# EAGLE design ioboard (EAGLE 9.6.2)
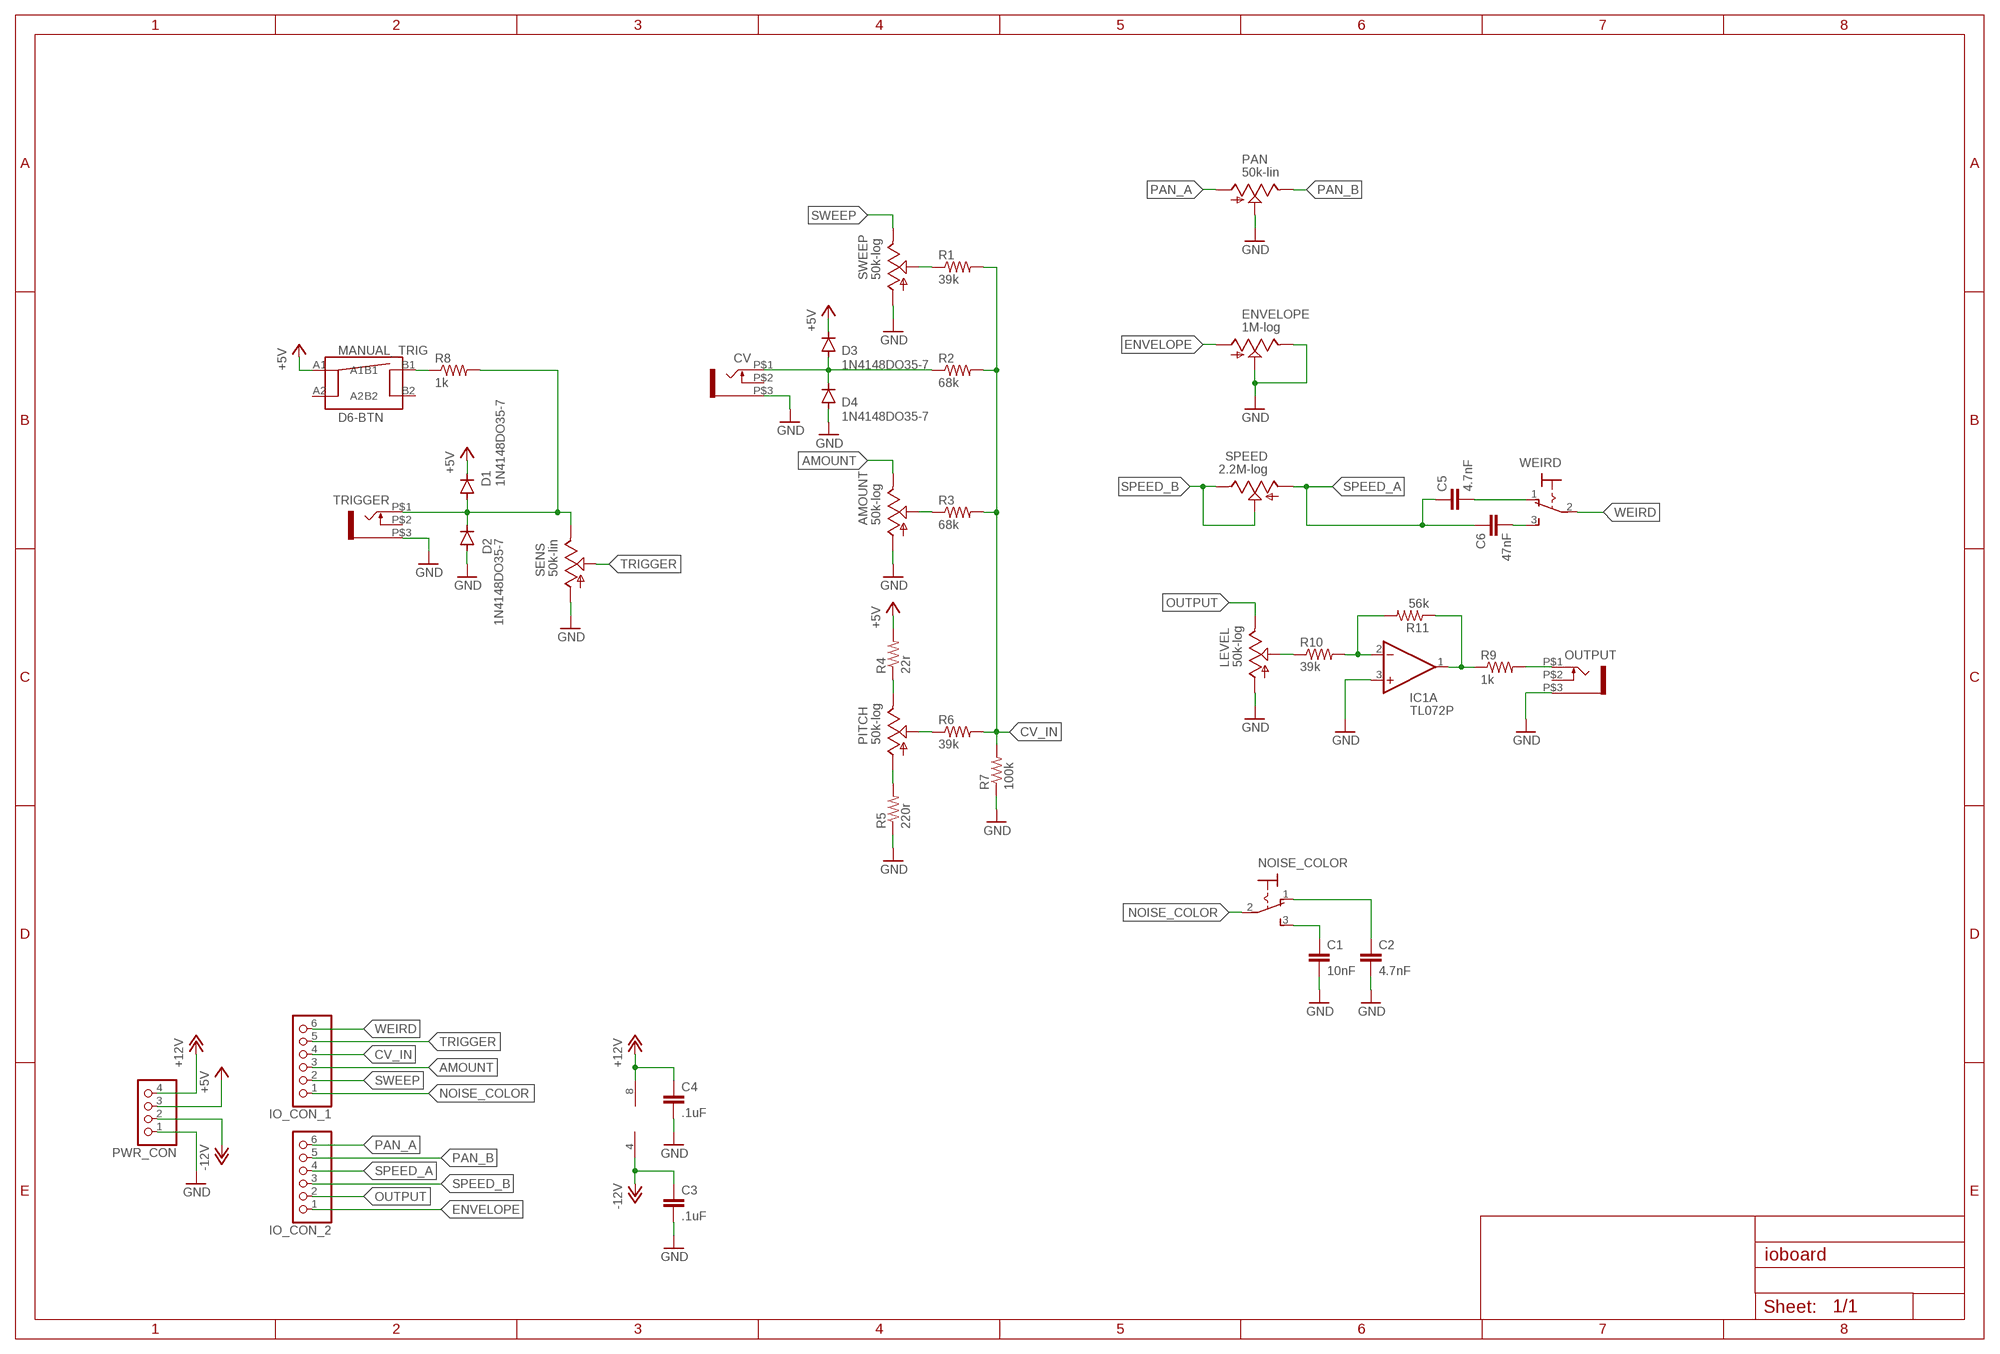
[diagram p0: schematic, sheet 1]

## Parts
AMOUNT  50k-log  ALPHA-9MMA  [EVUF]
C1  10nF  C-EU050-024X044  [C050-024X044]
C2  4.7nF  C-EU050-024X044  [C050-024X044]
C3  .1uF  C-EU050-024X044  [C050-024X044]
C4  .1uF  C-EU050-024X044  [C050-024X044]
C5  4.7nF  C-EU050-024X044  [C050-024X044]
C6  47nF  C-EU050-024X044  [C050-024X044]
CV  WQP-PJ301M-12_JACK  [WQP-PJ301M-12_JACK]
D1  1N4148DO35-7  [DO35-7]
D2  1N4148DO35-7  [DO35-7]
D3  1N4148DO35-7  [DO35-7]
D4  1N4148DO35-7  [DO35-7]
ENVELOPE  1M-log  ALPHA-9MMA  [EVUF]
IC1  TL072P  [DIL08]
IO_CON_1  PINHD-1X6  [1X06]
IO_CON_2  PINHD-1X6  [1X06]
LEVEL  50k-log  ALPHA-9MMA  [EVUF]
MANUAL_TRIG  D6-BTN  [D6-BTN]
NOISE_COLOR  M9040P  [M9040P]
OUTPUT  WQP-PJ301M-12_JACK  [WQP-PJ301M-12_JACK]
PAN  50k-lin  ALPHA-9MMA  [EVUF]
PITCH  50k-log  ALPHA-9MMA  [EVUF]
PWR_CON  PINHD-1X4  [1X04]
R1  39k  R-US_0207/7  [0207/7]
R2  68k  R-US_0207/7  [0207/7]
R3  68k  R-US_0207/7  [0207/7]
R4  22r  R-US_0207/7  [0207/7]
R5  220r  R-US_0207/7  [0207/7]
R6  39k  R-US_0207/7  [0207/7]
R7  100k  R-US_0207/7  [0207/7]
R8  1k  R-US_0207/7  [0207/7]
R9  1k  R-US_0207/7  [0207/7]
R10  39k  R-US_0207/7  [0207/7]
R11  56k  R-US_0207/7  [0207/7]
SENS  50k-lin  ALPHA-9MMA  [EVUF]
SPEED  2.2M-log  ALPHA-9MMA  [EVUF]
SWEEP  50k-log  ALPHA-9MMA  [EVUF]
TRIGGER  WQP-PJ301M-12_JACK  [WQP-PJ301M-12_JACK]
WEIRD  M9040P  [M9040P]

## Nets
+5V: D1.C D3.C MANUAL_TRIG.A1 PWR_CON.3 R4.2
+12V: C4.1 IC1.8(P:V+) PWR_CON.4
-12V: C3.1 IC1.4(P:V-) PWR_CON.2
AMOUNT: AMOUNT.3(E) IO_CON_1.3
CV_IN: IO_CON_1.4 R1.2 R2.2 R3.2 R6.2 R7.2
ENVELOPE: ENVELOPE.1(A) IO_CON_2.1
GND: AMOUNT.1(A) C1.2 C2.2 C3.2 C4.2 CV.P$3 D2.A D4.A ENVELOPE.2(S) ENVELOPE.3(E) IC1.3(A:+IN) LEVEL.1(A) OUTPUT.P$3 PAN.2(S) PWR_CON.1 R5.1 R7.1 SENS.1(A) SWEEP.1(A) TRIGGER.P$3
N$1: PITCH.1(A) R5.2
N$2: PITCH.2(S) R6.1
N$3: PITCH.3(E) R4.1
N$4: AMOUNT.2(S) R3.1
N$5: CV.P$1 D3.A D4.C R2.1
N$6: R1.1 SWEEP.2(S)
N$7: C1.1 NOISE_COLOR.3(S)
N$8: IC1.2(A:-IN) R10.2 R11.2
N$9: C2.1 NOISE_COLOR.1(O)
N$10: MANUAL_TRIG.B1 R8.1
N$11: C6.2 WEIRD.3(S)
N$12: OUTPUT.P$1 R9.2
N$13: IC1.1(A:OUT) R9.1 R11.1
N$14: LEVEL.2(S) R10.1
N$15: C5.2 WEIRD.1(O)
N$16: D1.A D2.C R8.2 SENS.3(E) TRIGGER.P$1
NOISE_COLOR: IO_CON_1.1 NOISE_COLOR.2(P)
OUTPUT: IO_CON_2.2 LEVEL.3(E)
PAN_A: IO_CON_2.6 PAN.1(A)
PAN_B: IO_CON_2.5 PAN.3(E)
SPEED_A: C5.1 C6.1 IO_CON_2.4 SPEED.1(A)
SPEED_B: IO_CON_2.3 SPEED.2(S) SPEED.3(E)
SWEEP: IO_CON_1.2 SWEEP.3(E)
TRIGGER: IO_CON_1.5 SENS.2(S)
WEIRD: IO_CON_1.6 WEIRD.2(P)
Unconnected: CV.P$2 IC1.5(B:+IN) IC1.6(B:-IN) IC1.7(B:OUT) MANUAL_TRIG.A2 MANUAL_TRIG.B2 OUTPUT.P$2 TRIGGER.P$2

## Library data of the parts
AMOUNT ENVELOPE LEVEL PAN PITCH SENS SPEED SWEEP = TomW:ALPHA-9MM: 9 mm Square Rotary Potentiometers Source: Panasonic
C1-C6 = rcl:C-EU: CAPACITOR, European symbol; SPICEPREFIX: C
CV OUTPUT TRIGGER = thonkiconn:WQP-PJ301M-12_JACK
D1-D4 = diode:1N4148: DIODE high speed (Philips)
IC1 = TomW:TL072: OP AMP
IO_CON_1 IO_CON_2 = pinhead:PINHD-1X6: PIN HEADER
MANUAL_TRIG = gerbster:D6-BTN
NOISE_COLOR WEIRD = switch:M9040P: TOGGLE SWITCH Marquardt
PWR_CON = pinhead:PINHD-1X4: PIN HEADER
R1-R11 = rcl:R-US_: RESISTOR, American symbol; SPICEPREFIX: R

## Board
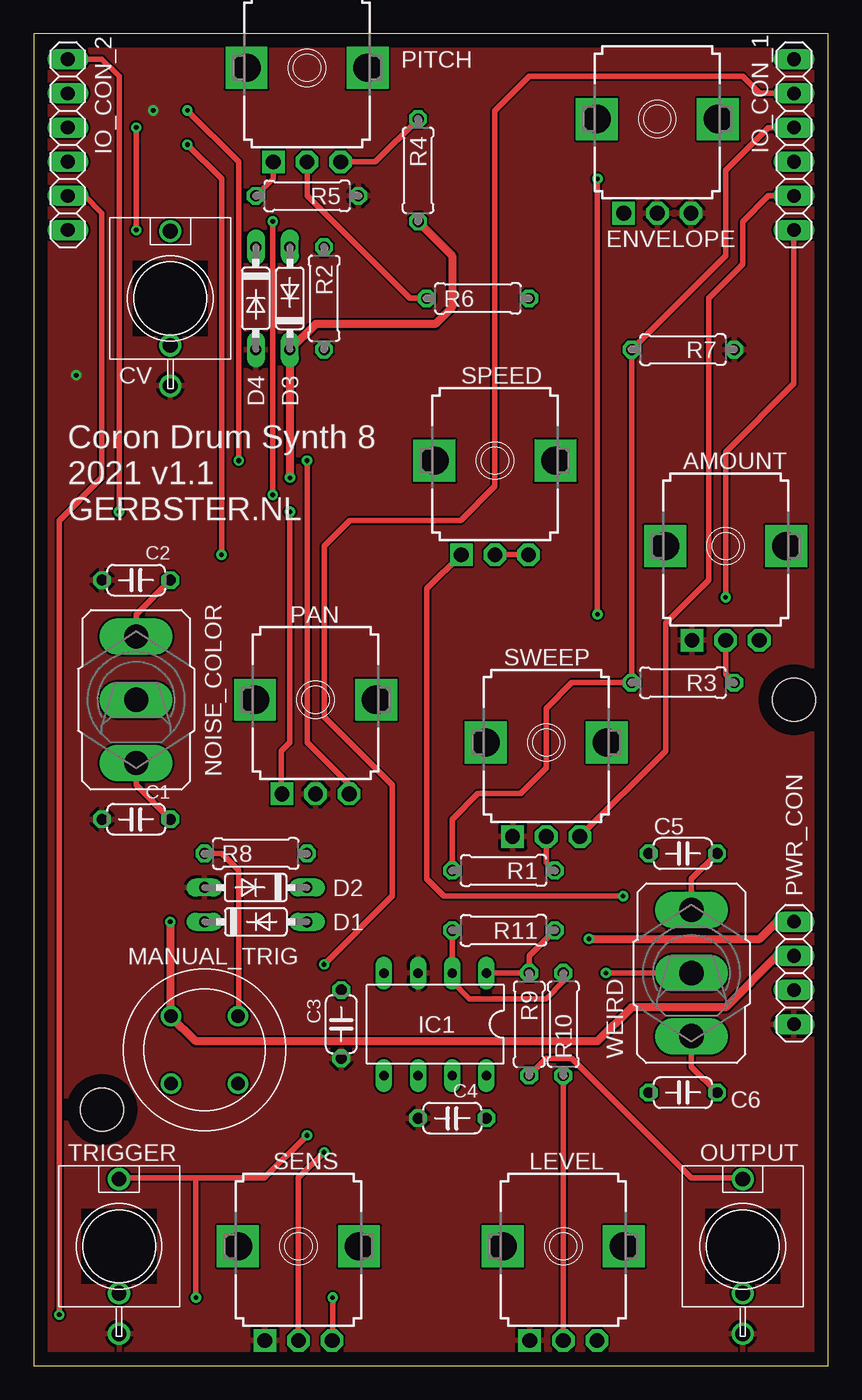
[diagram p1: board, top side]
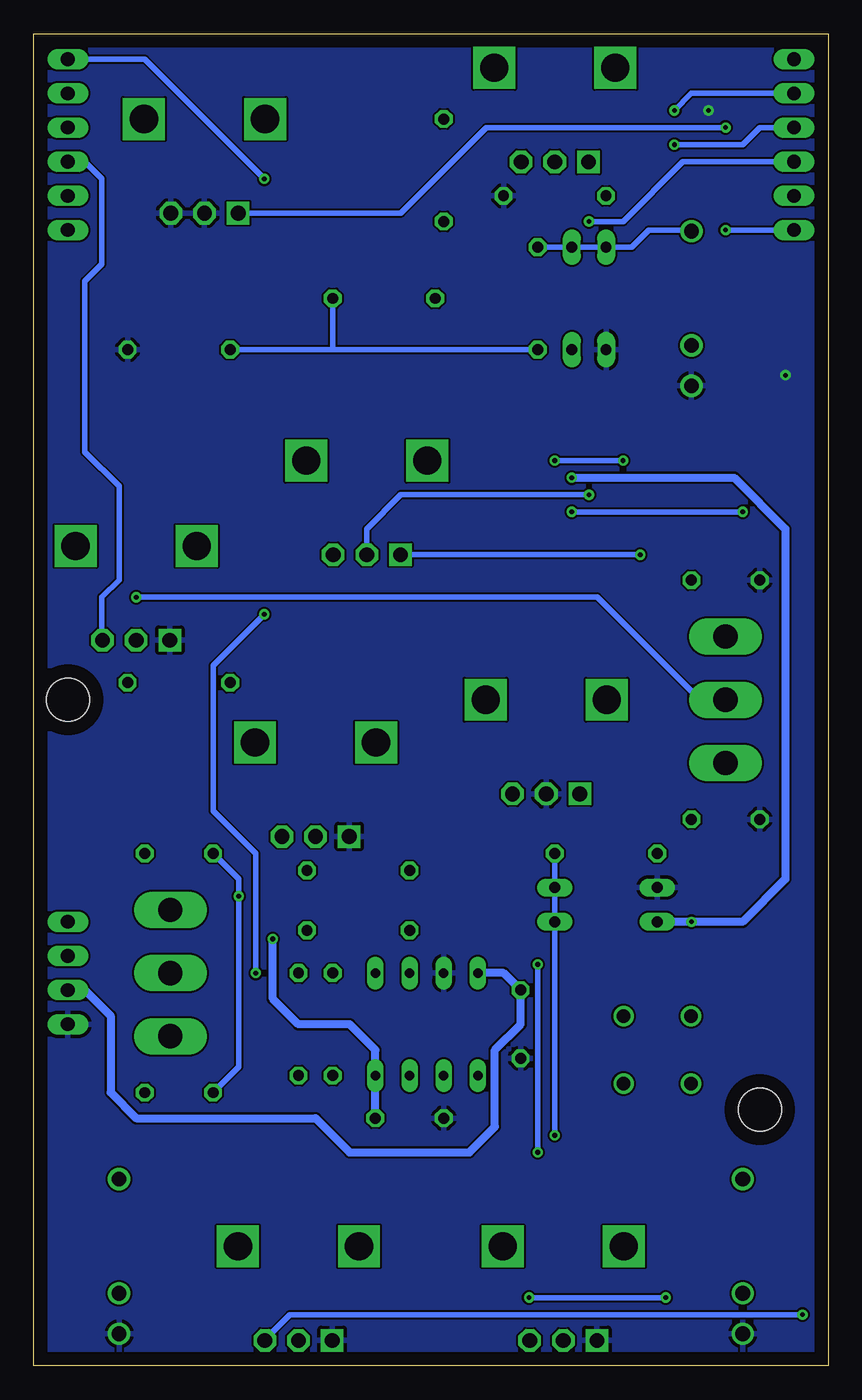
[diagram p2: board, bottom side, seen from below]

Size 59.05 x 99.06 mm. Coordinates in mm from the lower left corner, seen from the top.
Outline: 0,0 59.05,0 59.05,99.06 0,99.05 0,0
Copper layers (1*16): Top 0.035mm / dielectric 1.5mm / Bottom 0.035mm
Design rules "default": minimum track width 6mil, minimum drill 0.35mm, track to track 6mil, track to pad 6mil, pad to pad 6mil, via to via 6mil, smd to smd 6mil, copper to edge 40mil, drill to drill 6mil, minimum pad ring 10mil, minimum via ring 8mil, stop-mask expansion 4mil, vias tented up to drill 0mil, thermal gap 10mil
Holes 3.2 mm at 5.08,19.05 56.52,49.53

### Footprints (pad centres in the part's own frame; a part is rotated, then mirrored left to right if it is on the bottom)
EVUF = drill 1.1 pad 1.676 square: 1 -2.5,-7 | drill 1.1 pad 1.676 octagon: 2 0,-7; 3 2.5,-7 | drill 2.1 pad 2.8 square: M1 4.5,0; M2 -4.5,0
C050-024X044 = drill 0.813 octagon: 1 -2.54,0; 2 2.54,0
WQP-PJ301M-12_JACK = drill 1.1: P$1 0,5; P$2 0,-3.5; P$3 0,-6.5
DO35-7 = drill 0.813 long: A 3.81,0; C -3.81,0
DIL08 = drill 0.7 long: 1 -3.81,-3.81; 2 -1.27,-3.81; 3 1.27,-3.81; 4 3.81,-3.81; 5 3.81,3.81; 6 1.27,3.81; 7 -1.27,3.81; 8 -3.81,3.81
1X06 = drill 1.016 long: 1 -6.35,0; 2 -3.81,0; 3 -1.27,0; 4 1.27,0; 5 3.81,0; 6 6.35,0
D6-BTN = drill 1: A1 -2.5,2.5; A2 -2.5,-2.5; B1 2.5,2.5; B2 2.5,-2.5
M9040P = drill 1.803 long: 1 0,4.699; 2 0,0; 3 0,-4.699
1X04 = drill 1.016 long: 1 -3.81,0; 2 -1.27,0; 3 1.27,0; 4 3.81,0
0207/7 = drill 0.813 octagon: 1 -3.81,0; 2 3.81,0

### Placement (x,y rotation side)
AMOUNT  51.44,60.96 0 top
C1  7.62,40.64 180 top
C2  7.62,58.42 180 top
C3  22.86,25.4 270 top
C4  31.11,18.41 180 top
C5  48.26,38.1 0 top
C6  48.26,20.32 0 top
CV  10.16,79.38 0 top
D1  16.51,33.02 0 top
D2  16.51,35.56 180 top
D3  19.05,79.38 90 top
D4  16.51,79.38 270 top
ENVELOPE  46.35,92.71 0 top
IC1  29.84,25.4 180 top
IO_CON_1  56.52,90.81 90 top
IO_CON_2  2.54,90.81 90 top
LEVEL  39.37,8.89 0 top
MANUAL_TRIG  12.7,23.5 0 top
NOISE_COLOR  7.62,49.53 0 top
OUTPUT  52.7,8.89 0 top
PAN  20.95,49.53 0 top
PITCH  20.32,96.52 0 top
PWR_CON  56.52,29.21 90 top
R1  34.92,36.83 180 top
R2  21.59,79.38 270 top
R3  48.26,50.8 180 top
R4  28.57,88.9 270 top
R5  20.32,87 180 top
R6  33.02,79.38 0 top
R7  48.26,75.56 180 top
R8  16.51,38.1 0 top
R9  36.83,25.4 270 top
R10  39.37,25.4 90 top
R11  34.92,32.38 180 top
SENS  19.68,8.89 0 top
SPEED  34.29,67.31 0 top
SWEEP  38.1,46.35 0 top
TRIGGER  6.35,8.89 0 top
WEIRD  48.9,29.21 0 top

### Tracks (layer width: path | path; a pad name or v marks a point on that pad's centre or on a via)
+5V  (via drill 0.35)
  Top 0.406: 10.16,26 MANUAL_TRIG.A1
  Top 0.61: v10.16,33.02 10.16,26 12.06,24.13 41.91,24.13 44.45,26.67 51.44,26.67 55.24,30.48 PWR_CON.3 | R4.2 31.11,82.55 31.11,78.74 29.84,77.47 20.95,77.47 D3.C v19.05,66.04
  Bottom 0.61: D1.C v10.16,33.02 6.35,33.02 3.17,36.2 3.17,62.23 6.99,66.04 v19.05,66.04
+12V  (via drill 0.35)
  Top 0.61: v41.27,31.75 53.98,31.75 55.24,33.02 PWR_CON.4
  Bottom 0.61: C4.1 IC1.8 33.66,23.5 35.56,25.4 39.37,25.4 41.27,27.3 v41.27,31.75
-12V
  Bottom 0.61: IC1.4 24.13,29.21 C3.1 22.86,25.4 24.77,23.5 24.77,17.78 26.67,15.88 35.56,15.88 38.1,18.41 51.44,18.41 53.34,20.32 53.34,26.04 55.24,27.94 PWR_CON.2
AMOUNT
  Bottom 0.406: AMOUNT.3 53.94,53.98 arc3 53.98,53.98 53.98,57.15 52.7,58.42 52.7,65.41 55.24,67.94 55.24,80.64 53.98,81.92 53.98,88.27 55.24,89.53 IO_CON_1.3
CV_IN
  Top 0.406: R1.2 31.11,40.64 33.02,42.55 36.2,42.55 38.1,44.45 38.1,48.9 40.01,50.8 R3.2 R7.2 51.44,82.55 51.44,88.9 54.61,92.08 IO_CON_1.4
  Bottom 0.406: R2.2 36.83,75.56 | 36.83,75.56 R6.2 | R7.2 36.83,75.56
ENVELOPE  (via drill 0.35)
  Top 0.406: v43.81,85.72 ENVELOPE.1 | v7.62,84.45 v7.62,92.08
  Bottom 0.406: v43.81,85.72 31.75,85.72 25.4,92.08 v7.62,92.08 | IO_CON_2.1 v7.62,84.45
GND  (via drill 0.35)
  other vias: 3.17,73.66 8.89,93.34
  pour Bottom: 0,0 0,99.06 59.05,99.06 59.05,0
  pour Top: 0,0 0,99.06 59.05,99.06 59.05,0
N$1
  Top 0.406: PITCH.1 17.82,88.27 R5.2
N$2
  Top 0.406: PITCH.2 20.32,87 27.94,79.38 R6.1
N$3
  Top 0.406: PITCH.3 25.4,89.52 R4.1
N$4
  Top 0.406: AMOUNT.2 51.44,51.44 R3.1
N$5
  Bottom 0.406: R2.1 D3.A D4.C 14.61,83.19 13.34,84.45 10.16,84.45 CV.P$1
N$6
  Top 0.406: SWEEP.2 38.1,37.45 38.12,37.45 R1.1
N$7
  Top 0.406: C1.1 7.62,43.18 NOISE_COLOR.3
N$8
  Top 0.406: R10.2 39.37,28.57 38.1,27.3 32.38,27.3 31.11,28.57 IC1.2 R11.2
N$9
  Top 0.406: NOISE_COLOR.1 7.62,55.88 C2.1
N$10
  Top 0.406: R8.1 13.97,38.1 15.24,36.83 15.24,26 MANUAL_TRIG.B1
N$11
  Top 0.406: C6.2 48.9,22.23 WEIRD.3
N$12
  Top 0.406: OUTPUT.P$1 arc60 52.7,13.97 48.9,13.97 40.01,22.86 38.1,22.86 R9.2
N$13
  Top 0.406: IC1.1 R9.1 36.83,30.48 R11.1
N$14
  Top 0.406: R10.1 LEVEL.2
N$15
  Top 0.406: C5.2 48.9,36.2 WEIRD.1
N$16  (via drill 0.35)
  Top 0.406: SENS.3 22.18,1.91 22.23,1.91 v22.23,5.08 | v12.06,5.08 12.06,13.97 | 12.06,13.97 6.35,13.97 TRIGGER.P$1 | 12.06,13.97 17.14,13.97 v20.32,17.14
  Bottom 0.406: R8.2 D2.C D1.A v20.32,17.14 | v22.23,5.08 v12.06,5.08
NOISE_COLOR  (via drill 0.35)
  Top 0.406: v51.44,57.15 51.44,67.94 56.52,73.03 IO_CON_1.1
  Bottom 0.406: NOISE_COLOR.2 9.53,49.53 17.14,57.15 v51.44,57.15
OUTPUT  (via drill 0.35)
  Top 0.406: IO_CON_2.2 3.81,87 5.08,85.72 5.08,66.04 1.91,62.87 v1.91,3.81 | v41.91,1.89 LEVEL.3
  Bottom 0.406: v41.91,1.89 40.01,3.81 v1.91,3.81
PAN_A  (via drill 0.35)
  Top 0.406: IO_CON_2.6 5.08,97.16 6.35,95.89 v6.35,63.5 | v19.05,63.5 19.05,46.35 18.41,45.72 18.41,42.53 PAN.1
  Bottom 0.406: v6.35,63.5 v19.05,63.5
PAN_B  (via drill 0.35)
  Top 0.406: PAN.3 23.5,42.55 23.5,43.18 20.32,46.35 v20.32,67.31 | v15.24,67.31 15.24,89.53 v11.43,93.34
  Bottom 0.406: v20.32,67.31 v15.24,67.31 | v11.43,93.34 10.16,94.61 IO_CON_2.5
SPEED_A  (via drill 0.35)
  Top 0.406: SPEED.1 31.79,60.33 29.21,57.78 29.21,36.2 30.48,34.92 v43.81,34.92 | v11.43,90.81 13.97,88.27 v13.97,60.31
  Bottom 0.406: C6.1 43.81,22.23 v43.81,34.92 43.81,36.2 C5.1 | SPEED.1 v13.97,60.31 | v11.43,90.81 6.35,90.81 5.08,92.08 IO_CON_2.4
SPEED_B  (via drill 0.35)
  Top 0.406: SPEED.3 SPEED.2 | v17.78,85.09 v17.78,64.77
  Bottom 0.406: SPEED.2 34.29,62.23 31.75,64.77 v17.78,64.77 | IO_CON_2.3 10.79,89.53 15.24,85.09 v17.78,85.09
SWEEP
  Top 0.406: IO_CON_1.2 54.61,87 52.7,85.09 52.7,81.92 50.16,79.38 50.16,58.42 46.99,55.24 46.99,45.72 40.6,39.37 SWEEP.3
TRIGGER  (via drill 0.35)
  Top 0.406: IO_CON_1.5 53.98,94.61 52.7,95.89 36.83,95.89 34.29,93.34 34.29,65.41 31.75,62.87 23.5,62.87 21.59,60.96 21.59,48.26 26.67,43.18 26.67,34.92 v21.59,29.84 | v21.59,15.88 19.68,13.97 SENS.2
  Bottom 0.406: v21.59,29.84 v21.59,15.88
WEIRD  (via drill 0.35)
  Top 0.406: v42.55,29.21 WEIRD.2 | v41.91,88.27 v41.91,55.88
  Bottom 0.406: IO_CON_1.6 50.8,97.16 v41.91,88.27 | v41.91,55.88 45.72,52.07 45.72,41.27 42.55,38.1 v42.55,29.21

### Text on the board
tNames: Coron Drum Synth 8 / 2021 v1.1 / GERBSTER.NL